# Altium schematic sheet FPGA_HPCC_A_BG33-34-35.SchDoc
size B; SheetNumber: 9; SheetTotal: 11
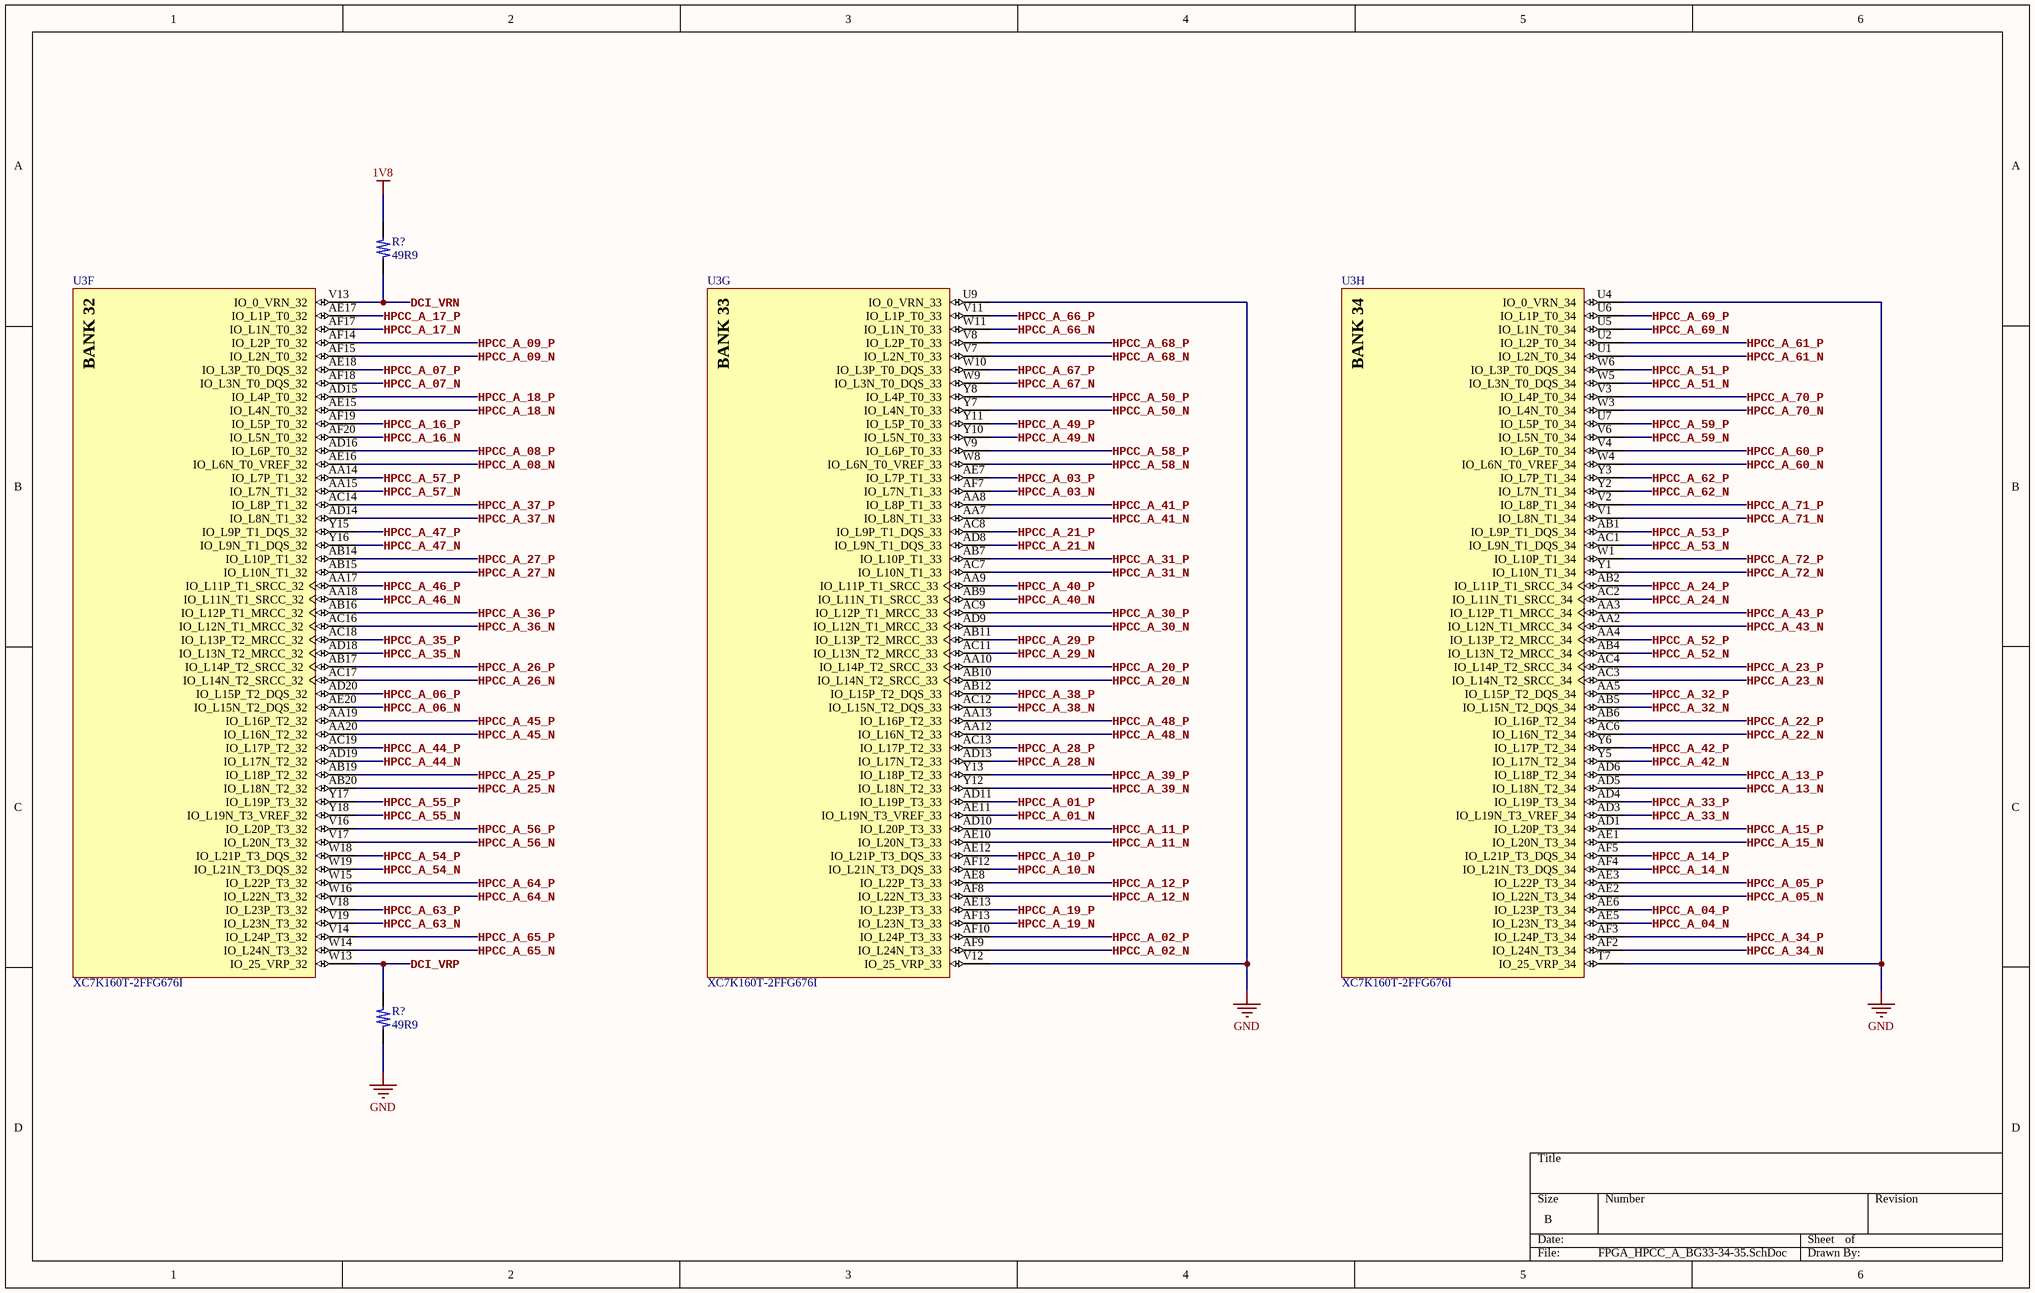
[diagram p0: FPGA_HPCC_A_BG33-34-35.SchDoc]

## Parts
(Parts that share a designator on the sheet are numbered #1, #2 ... from top to bottom, then left to right.)
R?#1  49R9  [R_0402_Generic]
R?#2  49R9  [R_0402_Generic]
U3  XC7K160T-2FFG676I  [FFG676_(XC7K160T-2FFG676I)]  (parts F,G,H of 14)

## Nets
1V8: R?#1.1
GND: R?#2.2 U3.T7(IO_25_VRP_34) U3.U4(IO_0_VRN_34) U3.U9(IO_0_VRN_33) U3.V12(IO_25_VRP_33)
DCI_VRN: R?#1.2 U3.V13(IO_0_VRN_32)
DCI_VRP: R?#2.1 U3.W13(IO_25_VRP_32)
HPCC_A_01_N: U3.AE11(IO_L19N_T3_VREF_33)
HPCC_A_01_P: U3.AD11(IO_L19P_T3_33)
HPCC_A_02_N: U3.AF9(IO_L24N_T3_33)
HPCC_A_02_P: U3.AF10(IO_L24P_T3_33)
HPCC_A_03_N: U3.AF7(IO_L7N_T1_33)
HPCC_A_03_P: U3.AE7(IO_L7P_T1_33)
HPCC_A_04_N: U3.AE5(IO_L23N_T3_34)
HPCC_A_04_P: U3.AE6(IO_L23P_T3_34)
HPCC_A_05_N: U3.AE2(IO_L22N_T3_34)
HPCC_A_05_P: U3.AE3(IO_L22P_T3_34)
HPCC_A_06_N: U3.AE20(IO_L15N_T2_DQS_32)
HPCC_A_06_P: U3.AD20(IO_L15P_T2_DQS_32)
HPCC_A_07_N: U3.AF18(IO_L3N_T0_DQS_32)
HPCC_A_07_P: U3.AE18(IO_L3P_T0_DQS_32)
HPCC_A_08_N: U3.AE16(IO_L6N_T0_VREF_32)
HPCC_A_08_P: U3.AD16(IO_L6P_T0_32)
HPCC_A_09_N: U3.AF15(IO_L2N_T0_32)
HPCC_A_09_P: U3.AF14(IO_L2P_T0_32)
HPCC_A_10_N: U3.AF12(IO_L21N_T3_DQS_33)
HPCC_A_10_P: U3.AE12(IO_L21P_T3_DQS_33)
HPCC_A_11_N: U3.AE10(IO_L20N_T3_33)
HPCC_A_11_P: U3.AD10(IO_L20P_T3_33)
HPCC_A_12_N: U3.AF8(IO_L22N_T3_33)
HPCC_A_12_P: U3.AE8(IO_L22P_T3_33)
HPCC_A_13_N: U3.AD5(IO_L18N_T2_34)
HPCC_A_13_P: U3.AD6(IO_L18P_T2_34)
HPCC_A_14_N: U3.AF4(IO_L21N_T3_DQS_34)
HPCC_A_14_P: U3.AF5(IO_L21P_T3_DQS_34)
HPCC_A_15_N: U3.AE1(IO_L20N_T3_34)
HPCC_A_15_P: U3.AD1(IO_L20P_T3_34)
HPCC_A_16_N: U3.AF20(IO_L5N_T0_32)
HPCC_A_16_P: U3.AF19(IO_L5P_T0_32)
HPCC_A_17_N: U3.AF17(IO_L1N_T0_32)
HPCC_A_17_P: U3.AE17(IO_L1P_T0_32)
HPCC_A_18_N: U3.AE15(IO_L4N_T0_32)
HPCC_A_18_P: U3.AD15(IO_L4P_T0_32)
HPCC_A_19_N: U3.AF13(IO_L23N_T3_33)
HPCC_A_19_P: U3.AE13(IO_L23P_T3_33)
HPCC_A_20_N: U3.AB10(IO_L14N_T2_SRCC_33)
HPCC_A_20_P: U3.AA10(IO_L14P_T2_SRCC_33)
HPCC_A_21_N: U3.AD8(IO_L9N_T1_DQS_33)
HPCC_A_21_P: U3.AC8(IO_L9P_T1_DQS_33)
HPCC_A_22_N: U3.AC6(IO_L16N_T2_34)
HPCC_A_22_P: U3.AB6(IO_L16P_T2_34)
HPCC_A_23_N: U3.AC3(IO_L14N_T2_SRCC_34)
HPCC_A_23_P: U3.AC4(IO_L14P_T2_SRCC_34)
HPCC_A_24_N: U3.AC2(IO_L11N_T1_SRCC_34)
HPCC_A_24_P: U3.AB2(IO_L11P_T1_SRCC_34)
HPCC_A_25_N: U3.AB20(IO_L18N_T2_32)
HPCC_A_25_P: U3.AB19(IO_L18P_T2_32)
HPCC_A_26_N: U3.AC17(IO_L14N_T2_SRCC_32)
HPCC_A_26_P: U3.AB17(IO_L14P_T2_SRCC_32)
HPCC_A_27_N: U3.AB15(IO_L10N_T1_32)
HPCC_A_27_P: U3.AB14(IO_L10P_T1_32)
HPCC_A_28_N: U3.AD13(IO_L17N_T2_33)
HPCC_A_28_P: U3.AC13(IO_L17P_T2_33)
HPCC_A_29_N: U3.AC11(IO_L13N_T2_MRCC_33)
HPCC_A_29_P: U3.AB11(IO_L13P_T2_MRCC_33)
HPCC_A_30_N: U3.AD9(IO_L12N_T1_MRCC_33)
HPCC_A_30_P: U3.AC9(IO_L12P_T1_MRCC_33)
HPCC_A_31_N: U3.AC7(IO_L10N_T1_33)
HPCC_A_31_P: U3.AB7(IO_L10P_T1_33)
HPCC_A_32_N: U3.AB5(IO_L15N_T2_DQS_34)
HPCC_A_32_P: U3.AA5(IO_L15P_T2_DQS_34)
HPCC_A_33_N: U3.AD3(IO_L19N_T3_VREF_34)
HPCC_A_33_P: U3.AD4(IO_L19P_T3_34)
HPCC_A_34_N: U3.AF2(IO_L24N_T3_34)
HPCC_A_34_P: U3.AF3(IO_L24P_T3_34)
HPCC_A_35_N: U3.AD18(IO_L13N_T2_MRCC_32)
HPCC_A_35_P: U3.AC18(IO_L13P_T2_MRCC_32)
HPCC_A_36_N: U3.AC16(IO_L12N_T1_MRCC_32)
HPCC_A_36_P: U3.AB16(IO_L12P_T1_MRCC_32)
HPCC_A_37_N: U3.AD14(IO_L8N_T1_32)
HPCC_A_37_P: U3.AC14(IO_L8P_T1_32)
HPCC_A_38_N: U3.AC12(IO_L15N_T2_DQS_33)
HPCC_A_38_P: U3.AB12(IO_L15P_T2_DQS_33)
HPCC_A_39_N: U3.Y12(IO_L18N_T2_33)
HPCC_A_39_P: U3.Y13(IO_L18P_T2_33)
HPCC_A_40_N: U3.AB9(IO_L11N_T1_SRCC_33)
HPCC_A_40_P: U3.AA9(IO_L11P_T1_SRCC_33)
HPCC_A_41_N: U3.AA7(IO_L8N_T1_33)
HPCC_A_41_P: U3.AA8(IO_L8P_T1_33)
HPCC_A_42_N: U3.Y5(IO_L17N_T2_34)
HPCC_A_42_P: U3.Y6(IO_L17P_T2_34)
HPCC_A_43_N: U3.AA2(IO_L12N_T1_MRCC_34)
HPCC_A_43_P: U3.AA3(IO_L12P_T1_MRCC_34)
HPCC_A_44_N: U3.AD19(IO_L17N_T2_32)
HPCC_A_44_P: U3.AC19(IO_L17P_T2_32)
HPCC_A_45_N: U3.AA20(IO_L16N_T2_32)
HPCC_A_45_P: U3.AA19(IO_L16P_T2_32)
HPCC_A_46_N: U3.AA18(IO_L11N_T1_SRCC_32)
HPCC_A_46_P: U3.AA17(IO_L11P_T1_SRCC_32)
HPCC_A_47_N: U3.Y16(IO_L9N_T1_DQS_32)
HPCC_A_47_P: U3.Y15(IO_L9P_T1_DQS_32)
HPCC_A_48_N: U3.AA12(IO_L16N_T2_33)
HPCC_A_48_P: U3.AA13(IO_L16P_T2_33)
HPCC_A_49_N: U3.Y10(IO_L5N_T0_33)
HPCC_A_49_P: U3.Y11(IO_L5P_T0_33)
HPCC_A_50_N: U3.Y7(IO_L4N_T0_33)
HPCC_A_50_P: U3.Y8(IO_L4P_T0_33)
HPCC_A_51_N: U3.W5(IO_L3N_T0_DQS_34)
HPCC_A_51_P: U3.W6(IO_L3P_T0_DQS_34)
HPCC_A_52_N: U3.AB4(IO_L13N_T2_MRCC_34)
HPCC_A_52_P: U3.AA4(IO_L13P_T2_MRCC_34)
HPCC_A_53_N: U3.AC1(IO_L9N_T1_DQS_34)
HPCC_A_53_P: U3.AB1(IO_L9P_T1_DQS_34)
HPCC_A_54_N: U3.W19(IO_L21N_T3_DQS_32)
HPCC_A_54_P: U3.W18(IO_L21P_T3_DQS_32)
HPCC_A_55_N: U3.Y18(IO_L19N_T3_VREF_32)
HPCC_A_55_P: U3.Y17(IO_L19P_T3_32)
HPCC_A_56_N: U3.V17(IO_L20N_T3_32)
HPCC_A_56_P: U3.V16(IO_L20P_T3_32)
HPCC_A_57_N: U3.AA15(IO_L7N_T1_32)
HPCC_A_57_P: U3.AA14(IO_L7P_T1_32)
HPCC_A_58_N: U3.W8(IO_L6N_T0_VREF_33)
HPCC_A_58_P: U3.V9(IO_L6P_T0_33)
HPCC_A_59_N: U3.V6(IO_L5N_T0_34)
HPCC_A_59_P: U3.U7(IO_L5P_T0_34)
HPCC_A_60_N: U3.W4(IO_L6N_T0_VREF_34)
HPCC_A_60_P: U3.V4(IO_L6P_T0_34)
HPCC_A_61_N: U3.U1(IO_L2N_T0_34)
HPCC_A_61_P: U3.U2(IO_L2P_T0_34)
HPCC_A_62_N: U3.Y2(IO_L7N_T1_34)
HPCC_A_62_P: U3.Y3(IO_L7P_T1_34)
HPCC_A_63_N: U3.V19(IO_L23N_T3_32)
HPCC_A_63_P: U3.V18(IO_L23P_T3_32)
HPCC_A_64_N: U3.W16(IO_L22N_T3_32)
HPCC_A_64_P: U3.W15(IO_L22P_T3_32)
HPCC_A_65_N: U3.W14(IO_L24N_T3_32)
HPCC_A_65_P: U3.V14(IO_L24P_T3_32)
HPCC_A_66_N: U3.W11(IO_L1N_T0_33)
HPCC_A_66_P: U3.V11(IO_L1P_T0_33)
HPCC_A_67_N: U3.W9(IO_L3N_T0_DQS_33)
HPCC_A_67_P: U3.W10(IO_L3P_T0_DQS_33)
HPCC_A_68_N: U3.V7(IO_L2N_T0_33)
HPCC_A_68_P: U3.V8(IO_L2P_T0_33)
HPCC_A_69_N: U3.U5(IO_L1N_T0_34)
HPCC_A_69_P: U3.U6(IO_L1P_T0_34)
HPCC_A_70_N: U3.W3(IO_L4N_T0_34)
HPCC_A_70_P: U3.V3(IO_L4P_T0_34)
HPCC_A_71_N: U3.V1(IO_L8N_T1_34)
HPCC_A_71_P: U3.V2(IO_L8P_T1_34)
HPCC_A_72_N: U3.Y1(IO_L10N_T1_34)
HPCC_A_72_P: U3.W1(IO_L10P_T1_34)

## Notes on the sheet
- (in symbol XC7K160T, part F) BANK 32
- (in symbol XC7K160T, part G) BANK 33
- (in symbol XC7K160T, part H) BANK 34

## Library data of the parts
R?#1 R?#2 = ERJ-2RKD49R9X: 49.9Ohm 0.5% 1/16W SMD resistor in 0402 size; Manufacturer: Panasonic; Manufacturer Part Number: ERJ-2RKD49R9X
U3 = XC7K160T: Kintex-7 FPGA, 400 User I/Os, 8 GTX, 676-Ball BGA, Speed Grade 2, Industrial Grade, Pb-Free; Manufacturer: AMD/Xilinx; Manufacturer Part Number: XC7K160T-2FFG676I